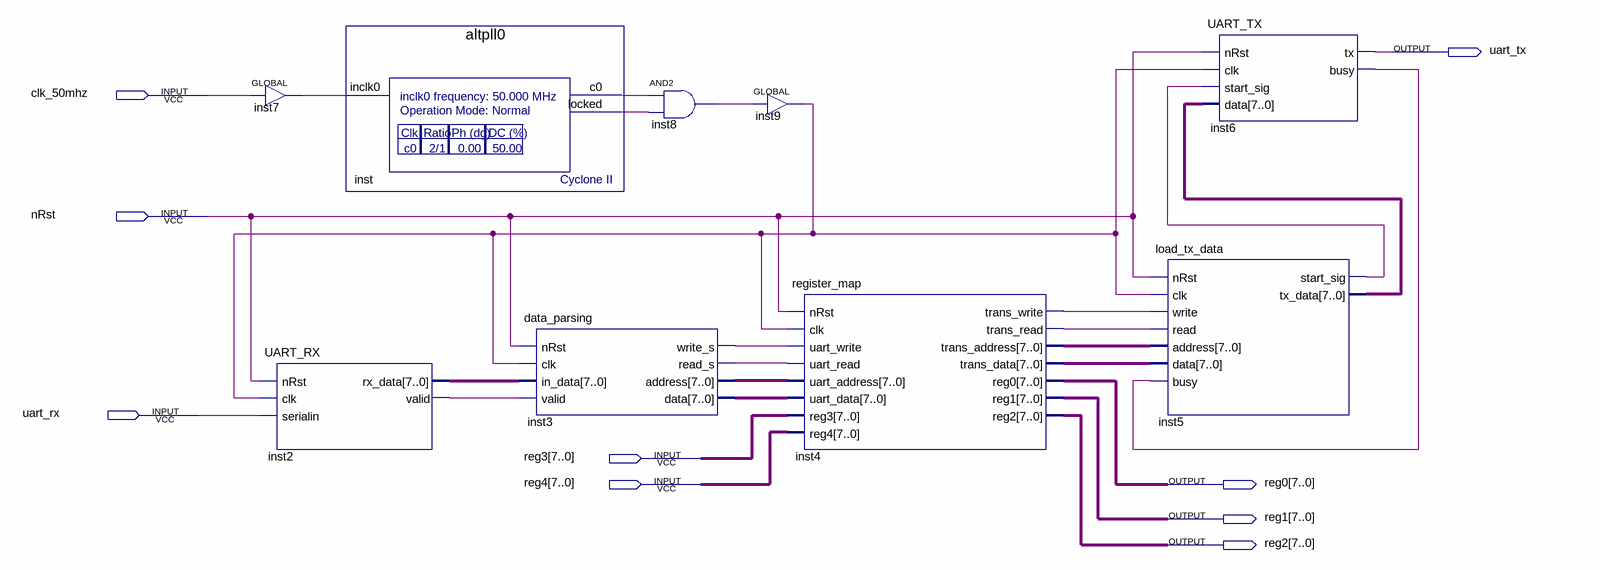
[diagram p0: schematic sheet]
// Quartus schematic ALL_regi_map.bdf as structural Verilog: 9 symbols, 9 pins
module ALL_regi_map (
  input  clk_50mhz,
  input  nRst,
  input  uart_rx,
  input  [7:0] reg3,
  input  [7:0] reg4,
  output uart_tx,
  output [7:0] reg0,
  output [7:0] reg1,
  output [7:0] reg2
);

  wire inst2_valid, inst3_read_s, inst3_write_s, inst4_trans_read, inst4_trans_write, inst5_start_sig,
       inst6_busy, inst7_out, inst8_out, inst9_out, inst_c0, inst_locked;
  wire [7:0] inst2_rx_data, inst3_address, inst3_data, inst4_trans_address, inst4_trans_data, inst5_tx_data;

  GLOBAL inst7 (.IN(clk_50mhz), .OUT(inst7_out));
  UART_RX inst2 (.nRst(nRst), .clk(inst9_out), .serialin(uart_rx), .rx_data(inst2_rx_data), .valid(inst2_valid));
  altpll0 inst (.inclk0(inst7_out), .c0(inst_c0), .locked(inst_locked));
  data_parsing inst3 (
    .nRst(nRst), .clk(inst9_out), .in_data(inst2_rx_data), .valid(inst2_valid), .write_s(inst3_write_s),
    .read_s(inst3_read_s), .address(inst3_address), .data(inst3_data));
  and inst8 (inst8_out, inst_c0, inst_locked);
  GLOBAL inst9 (.IN(inst8_out), .OUT(inst9_out));
  register_map inst4 (
    .nRst(nRst), .clk(inst9_out), .uart_write(inst3_write_s), .uart_read(inst3_read_s),
    .uart_address(inst3_address), .uart_data(inst3_data), .reg3(reg3), .reg4(reg4),
    .trans_write(inst4_trans_write), .trans_read(inst4_trans_read), .trans_address(inst4_trans_address),
    .trans_data(inst4_trans_data), .reg0(reg0), .reg1(reg1), .reg2(reg2));
  load_tx_data inst5 (
    .nRst(nRst), .clk(inst9_out), .write(inst4_trans_write), .read(inst4_trans_read),
    .address(inst4_trans_address), .data(inst4_trans_data), .busy(inst6_busy), .start_sig(inst5_start_sig),
    .tx_data(inst5_tx_data));
  UART_TX inst6 (
    .nRst(nRst), .clk(inst9_out), .start_sig(inst5_start_sig), .data(inst5_tx_data), .tx(uart_tx),
    .busy(inst6_busy));
endmodule
